# EasyEDA schematic Pratica 06.json
TITLE: Sheet_1; REV: 1.0; Date: 2021-08-27; Sheet: 1/1; Drawn By: Davi Pasquini; Company: Your Company
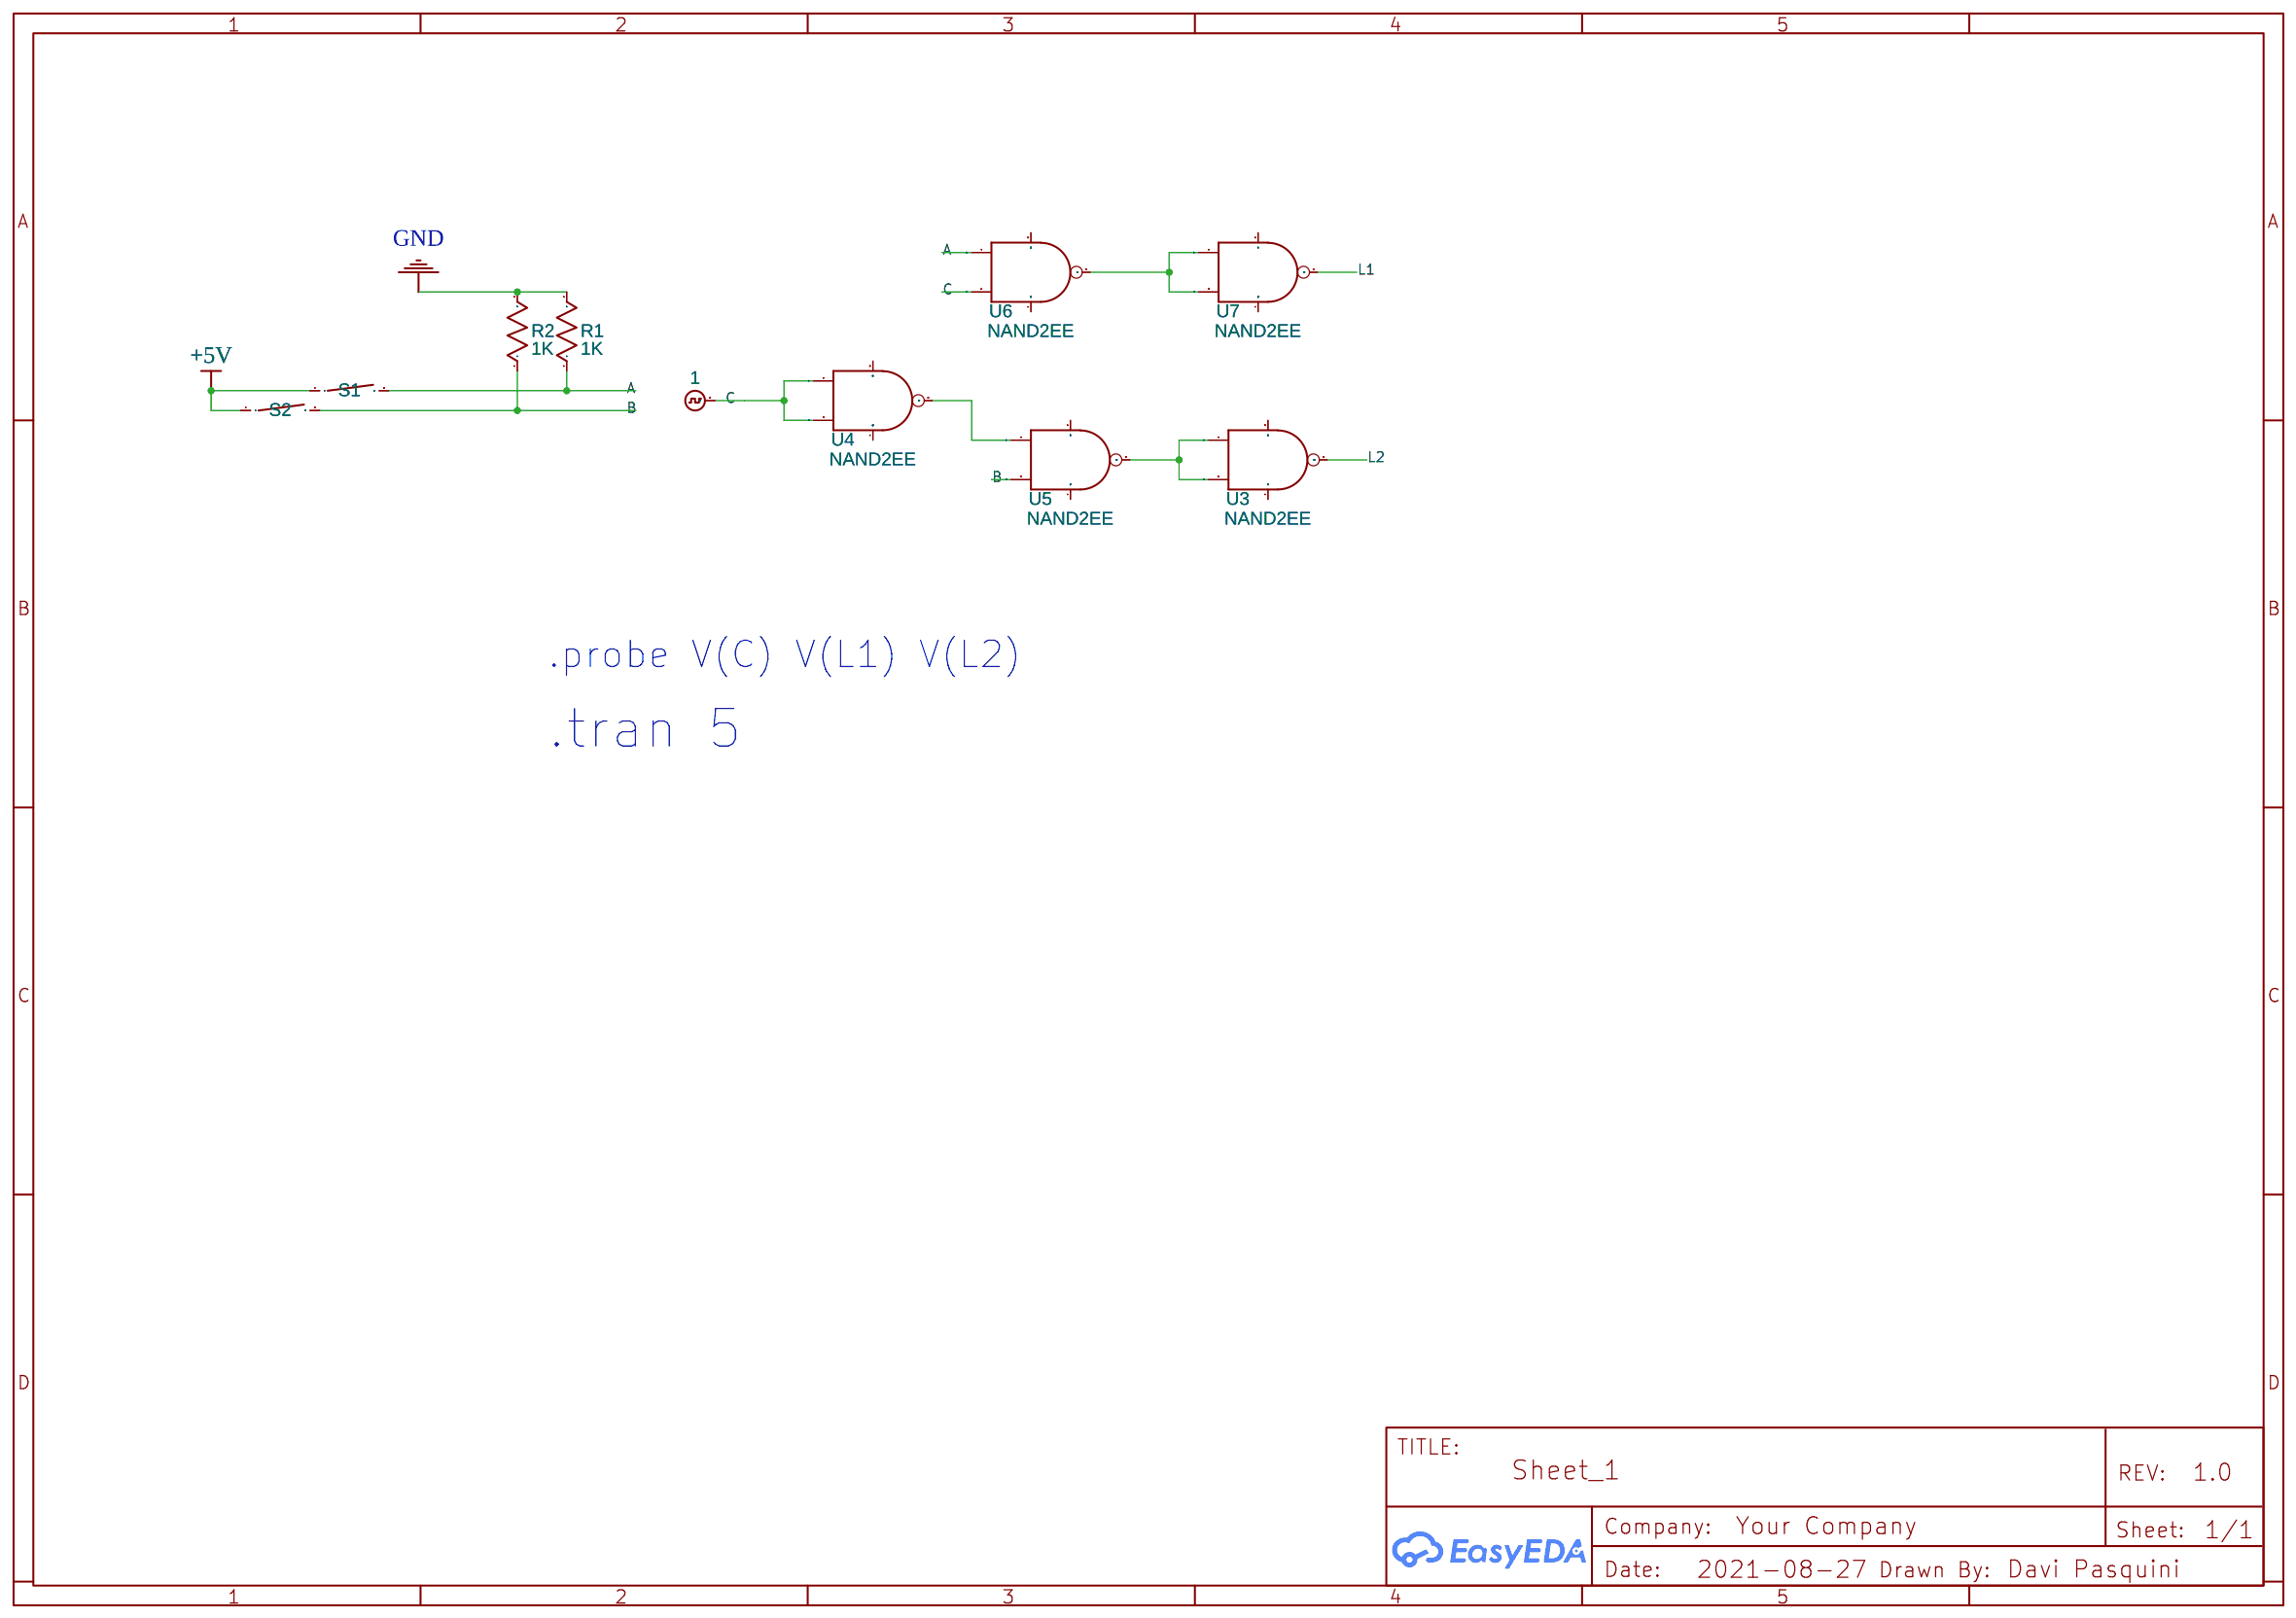
[diagram p0: schematic sheet]

## Parts
R1  1K  [AXIAL-0.3]
R2  1K  [AXIAL-0.3]
S1  SPST_Open
S2  SPST_Open
U1  1
U3  NAND2EE
U4  NAND2EE
U5  NAND2EE
U6  NAND2EE
U7  NAND2EE

## Library data of the parts
R1 R2 = Resistor_US: Resistance: 1k; Contributor: EasyEDA; Supplier: YUJING
S1 S2 = SPST: catid: 20; State: Close; Contributor: EasyEDA; NameDisplay: 0
U1 = DIGITALCLOCK: Contributor: EasyEDA; PreDisplay: 0
U3-U7 = LOGIC: Contributor: EasyEDA

## Nets
+5V: S1.1 S2.1
GND: R1.2 R2.2
A: R1.1 S1.2 U6.1(INA)
B: R2.1 S2.2 U5.2(INB)
C: U1.1 U4.1(INA) U4.2(INB) U6.2(INB)
L1: U7.5(OUT)
L2: U3.5(OUT)
Net-(U3-1): U3.1(INA) U3.2(INB) U5.5(OUT)
Net-(U4-5): U4.5(OUT) U5.1(INA)
Net-(U6-5): U6.5(OUT) U7.1(INA) U7.2(INB)

Not connected (* = marked no-connect by the designer): U3 3(VDD) 4(GND); U4 3(VDD) 4(GND); U5 3(VDD) 4(GND); U6 3(VDD) 4(GND); U7 3(VDD) 4(GND)

## Notes on the sheet
- .probe V(C) V(L1) V(L2)
- .tran 5
